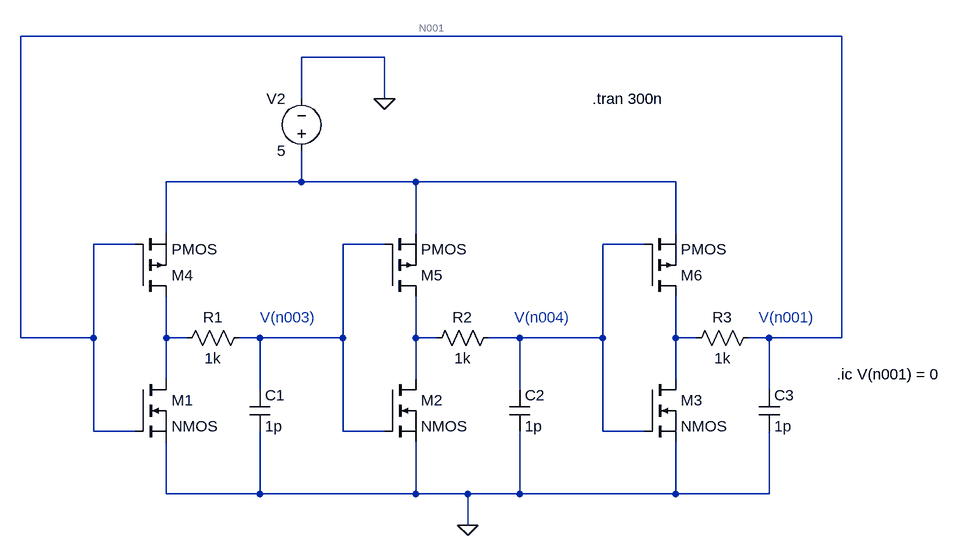
[diagram p0: schematic nopuls.asc]
nopuls.asc, the LTspice schematic file:
Version 4
SHEET 1 1120 680
WIRE 928 -320 -336 -320
WIRE 224 -288 96 -288
WIRE 96 -224 96 -288
WIRE 224 -224 224 -288
WIRE 96 -96 96 -144
WIRE 96 -96 -112 -96
WIRE 272 -96 96 -96
WIRE 672 -96 272 -96
WIRE -112 -16 -112 -96
WIRE 272 -16 272 -96
WIRE 672 -16 672 -96
WIRE -160 0 -224 0
WIRE 224 0 160 0
WIRE 624 0 560 0
WIRE -336 144 -336 -320
WIRE -224 144 -224 0
WIRE -224 144 -336 144
WIRE -112 144 -112 80
WIRE -80 144 -112 144
WIRE 32 144 0 144
WIRE 160 144 160 0
WIRE 160 144 32 144
WIRE 272 144 272 80
WIRE 304 144 272 144
WIRE 432 144 384 144
WIRE 560 144 560 0
WIRE 560 144 432 144
WIRE 672 144 672 80
WIRE 704 144 672 144
WIRE 816 144 784 144
WIRE 928 144 928 -320
WIRE 928 144 816 144
WIRE -112 208 -112 144
WIRE 272 208 272 144
WIRE 672 208 672 144
WIRE 32 224 32 144
WIRE 432 224 432 144
WIRE 816 224 816 144
WIRE -224 288 -224 144
WIRE -160 288 -224 288
WIRE 160 288 160 144
WIRE 224 288 160 288
WIRE 560 288 560 144
WIRE 624 288 560 288
WIRE -112 384 -112 304
WIRE 32 384 32 288
WIRE 32 384 -112 384
WIRE 272 384 272 304
WIRE 272 384 32 384
WIRE 352 384 272 384
WIRE 432 384 432 288
WIRE 432 384 352 384
WIRE 672 384 672 304
WIRE 672 384 432 384
WIRE 816 384 816 288
WIRE 816 384 672 384
WIRE 352 432 352 384
FLAG 352 432 0
FLAG 224 -224 0
SYMBOL nmos -160 208 R0
SYMATTR InstName M1
SYMBOL nmos 224 208 R0
SYMATTR InstName M2
SYMBOL nmos 624 208 R0
SYMATTR InstName M3
SYMBOL pmos -160 80 M180
SYMATTR InstName M4
SYMBOL pmos 224 80 M180
SYMATTR InstName M5
SYMBOL pmos 624 80 M180
SYMATTR InstName M6
SYMBOL res 16 128 R90
WINDOW 0 0 56 VBottom 2
WINDOW 3 32 56 VTop 2
SYMATTR InstName R1
SYMATTR Value 1k
SYMBOL res 400 128 R90
WINDOW 0 0 56 VBottom 2
WINDOW 3 32 56 VTop 2
SYMATTR InstName R2
SYMATTR Value 1k
SYMBOL res 800 128 R90
WINDOW 0 0 56 VBottom 2
WINDOW 3 32 56 VTop 2
SYMATTR InstName R3
SYMATTR Value 1k
SYMBOL cap 16 224 R0
SYMATTR InstName C1
SYMATTR Value 1p
SYMBOL cap 416 224 R0
SYMATTR InstName C2
SYMATTR Value 1p
SYMBOL cap 800 224 R0
SYMATTR InstName C3
SYMATTR Value 1p
SYMBOL voltage 96 -128 R180
WINDOW 0 24 96 Left 2
WINDOW 3 24 16 Left 2
WINDOW 123 0 0 Left 0
WINDOW 39 0 0 Left 0
SYMATTR InstName V2
SYMATTR Value 5
TEXT 544 -224 Left 2 !.tran 300n
TEXT 920 200 Left 2 !.ic V(n001) = 0
TEXT 800 112 Left 2 ;V(n001)
TEXT 32 112 Left 2 ;V(n003)
TEXT 424 112 Left 2 ;V(n004)

The netlist it stands for:
* nopuls.asc
M1 N005 N001 0 0 NMOS
M2 N006 N003 0 0 NMOS
M3 N007 N004 0 0 NMOS
M4 N005 N001 N002 N002 PMOS
M5 N006 N003 N002 N002 PMOS
M6 N007 N004 N002 N002 PMOS
R1 N003 N005 1k
R2 N004 N006 1k
R3 N001 N007 1k
C1 N003 0 1p
C2 N004 0 1p
C3 N001 0 1p
V2 N002 0 5
.model NMOS NMOS
.model PMOS PMOS
.lib standard.mos
.tran 300n
.ic V(n001) = 0
* V(n001)
* V(n003)
* V(n004)
.backanno
.end